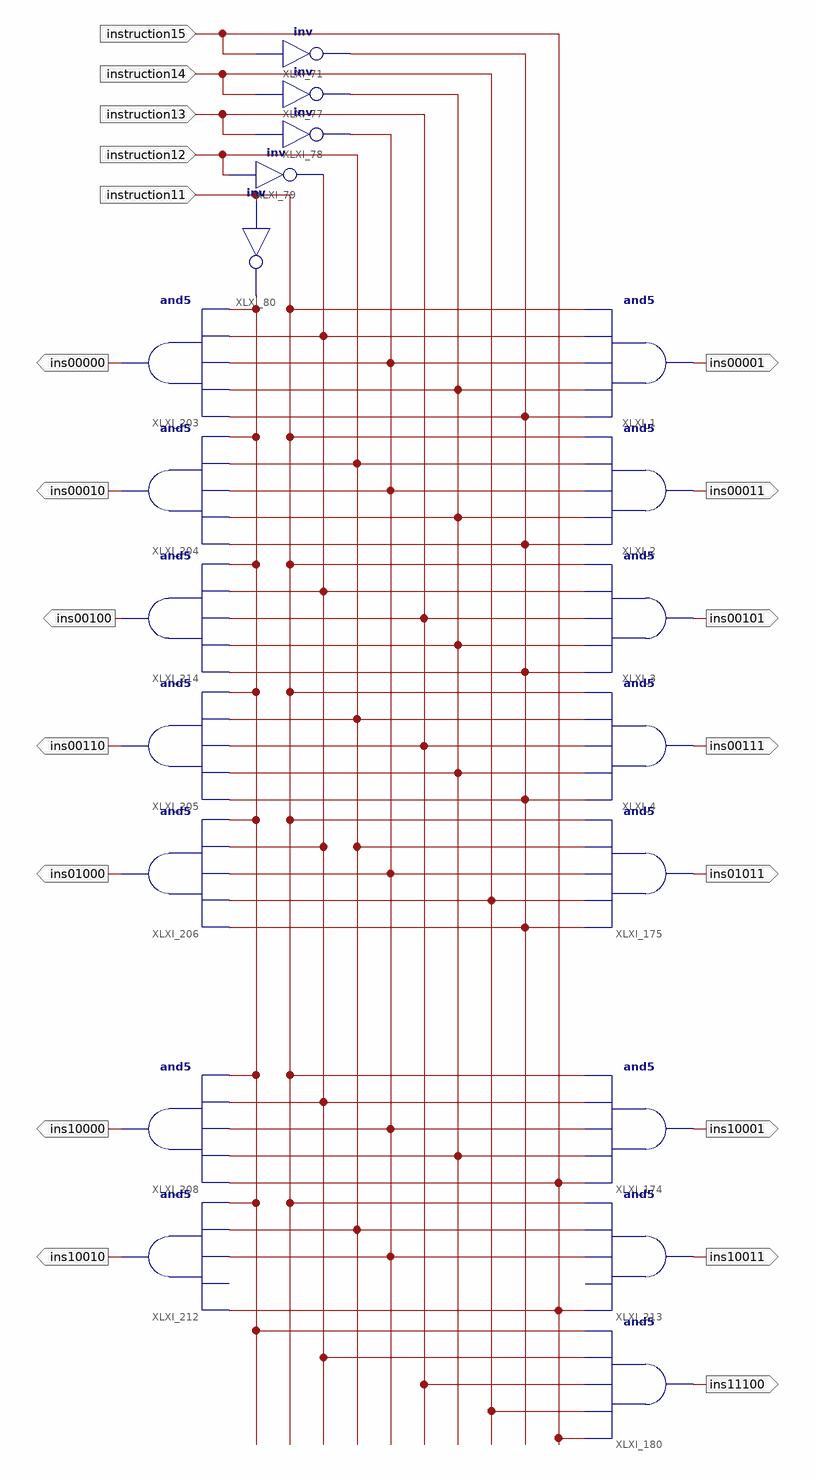
[diagram p0: schematic sheet 1]
// Xilinx ISE schematic sort5bit.sch (spartan6) as structural Verilog: 20 symbols, 20 ports
module sort5bit (
  input  instruction11,
  input  instruction12,
  input  instruction15,
  input  instruction13,
  input  instruction14,
  output ins00001,
  output ins00000,
  output ins00011,
  output ins00101,
  output ins00110,
  output ins00111,
  output ins01000,
  output ins00010,
  output ins01011,
  output ins10000,
  output ins10001,
  output ins10010,
  output ins10011,
  output ins11100,
  output ins00100
);

  wire XLXN_31, XLXN_33, XLXN_37, XLXN_132, XLXN_134;

  not XLXI_71 (XLXN_33, instruction15);
  not XLXI_77 (XLXN_134, instruction14);
  not XLXI_78 (XLXN_31, instruction13);
  not XLXI_79 (XLXN_37, instruction12);
  not XLXI_80 (XLXN_132, instruction11);
  and XLXI_1 (ins00001, XLXN_33, XLXN_134, XLXN_31, XLXN_37, instruction11);
  and XLXI_2 (ins00011, XLXN_33, XLXN_134, XLXN_31, instruction12, instruction11);
  and XLXI_3 (ins00101, XLXN_33, XLXN_134, instruction13, XLXN_37, instruction11);
  and XLXI_4 (ins00111, XLXN_33, XLXN_134, instruction13, instruction12, instruction11);
  and XLXI_174 (ins10001, instruction15, XLXN_134, XLXN_31, XLXN_37, instruction11);
  and XLXI_175 (ins01011, XLXN_33, instruction14, XLXN_31, instruction12, instruction11);
  and XLXI_180 (ins11100, instruction15, instruction14, instruction13, XLXN_37, XLXN_132);
  and XLXI_203 (ins00000, XLXN_33, XLXN_134, XLXN_31, XLXN_37, XLXN_132);
  and XLXI_204 (ins00010, XLXN_33, XLXN_134, XLXN_31, instruction12, XLXN_132);
  and XLXI_205 (ins00110, XLXN_33, XLXN_134, instruction13, instruction12, XLXN_132);
  and XLXI_206 (ins01000, XLXN_33, instruction14, XLXN_31, XLXN_37, XLXN_132);
  and XLXI_208 (ins10000, instruction15, XLXN_134, XLXN_31, XLXN_37, XLXN_132);
  and XLXI_212 (ins10010, instruction15, XLXN_31, instruction12, XLXN_132);  // open: I1
  and XLXI_213 (ins10011, instruction15, XLXN_31, instruction12, instruction11);  // open: I1
  and XLXI_214 (ins00100, XLXN_33, XLXN_134, instruction13, XLXN_37, XLXN_132);
endmodule
